# Altium project Switch Board PCB.PrjPcb
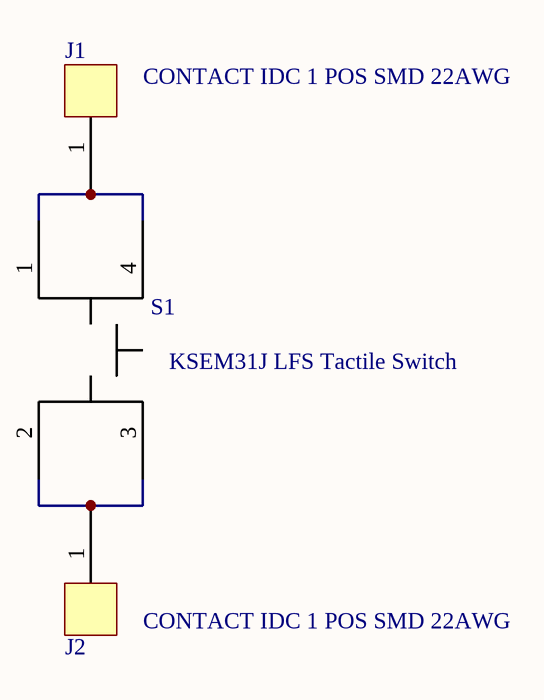
[diagram p0: Switch Board Sch.SchDoc]
1 sheet, 3 parts. Net scope: global (net labels, ports and power ports of the same name join across sheets).
Board files: Switch Board.PcbDoc, SwitchPanelized.PcbDoc

## Sheet Switch Board Sch.SchDoc
size A

### Parts
J1  CONTACT IDC 1 POS SMD 22AWG  [CONTACT IDC 1 POS SMD 22AWG]
J2  CONTACT IDC 1 POS SMD 22AWG  [CONTACT IDC 1 POS SMD 22AWG]
S1  KSEM31J LFS Tactile Switch  [KSEM31J LFS Tactile Switch]

### Nets
NetJ1_1: J1.1 S1.1(A) S1.4(A)
NetJ2_1: J2.1 S1.2(B) S1.3(B)